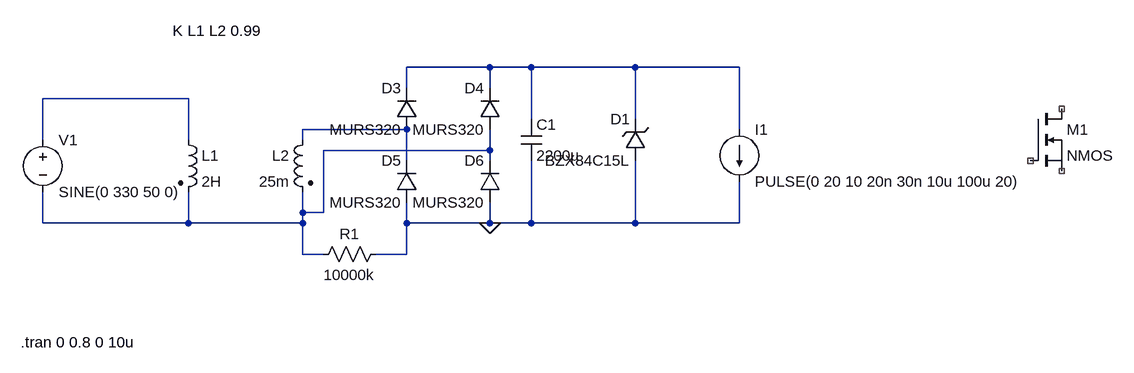
[diagram p0: schematic DRSSTC_driver_supply.asc]
DRSSTC_driver_supply.asc, the LTspice schematic file:
Version 4
SHEET 1 1932 964
WIRE -80 48 -208 48
WIRE -16 48 -80 48
WIRE 144 48 -16 48
WIRE 304 48 144 48
WIRE -208 80 -208 48
WIRE -80 80 -80 48
WIRE -544 96 -768 96
WIRE -16 128 -16 48
WIRE 144 128 144 48
WIRE -208 144 -368 144
WIRE 304 144 304 48
WIRE -768 160 -768 96
WIRE -544 160 -544 96
WIRE -368 160 -368 144
WIRE -80 176 -80 144
WIRE -80 176 -336 176
WIRE -208 192 -208 144
WIRE -80 192 -80 176
WIRE -368 272 -368 240
WIRE -336 272 -336 176
WIRE -336 272 -368 272
WIRE -768 288 -768 240
WIRE -544 288 -544 240
WIRE -544 288 -768 288
WIRE -368 288 -368 272
WIRE -368 288 -544 288
WIRE -208 288 -208 256
WIRE -80 288 -80 256
WIRE -80 288 -208 288
WIRE -16 288 -16 192
WIRE -16 288 -80 288
WIRE 144 288 144 192
WIRE 144 288 -16 288
WIRE 304 288 304 224
WIRE 304 288 144 288
WIRE -368 336 -368 288
WIRE -336 336 -368 336
WIRE -208 336 -208 288
WIRE -208 336 -256 336
FLAG -80 288 0
SYMBOL zener 160 192 R180
WINDOW 0 24 64 Left 2
WINDOW 3 24 0 Left 2
SYMATTR InstName D1
SYMATTR Value BZX84C15L
SYMBOL ind2 -560 144 R0
SYMATTR InstName L1
SYMATTR Value 2H
SYMATTR Type ind
SYMATTR SpiceLine Rser=1k
SYMBOL ind2 -352 144 M0
SYMATTR InstName L2
SYMATTR Value 25m
SYMATTR Type ind
SYMATTR SpiceLine Rser=53
SYMBOL voltage -768 144 R0
WINDOW 123 0 0 Left 2
WINDOW 39 0 0 Left 2
SYMATTR InstName V1
SYMATTR Value SINE(0 330 50 0)
SYMBOL diode -192 144 R180
WINDOW 0 24 64 Left 2
WINDOW 3 24 0 Left 2
SYMATTR InstName D3
SYMATTR Value MURS320
SYMBOL diode -64 144 R180
WINDOW 0 24 64 Left 2
WINDOW 3 24 0 Left 2
SYMATTR InstName D4
SYMATTR Value MURS320
SYMBOL diode -192 256 R180
WINDOW 0 24 64 Left 2
WINDOW 3 24 0 Left 2
SYMATTR InstName D5
SYMATTR Value MURS320
SYMBOL diode -64 256 R180
WINDOW 0 24 64 Left 2
WINDOW 3 24 0 Left 2
SYMATTR InstName D6
SYMATTR Value MURS320
SYMBOL cap -32 128 R0
SYMATTR InstName C1
SYMATTR Value 2200µ
SYMBOL res -240 320 R90
WINDOW 0 0 56 VBottom 2
WINDOW 3 32 56 VTop 2
SYMATTR InstName R1
SYMATTR Value 10000k
SYMBOL current 304 144 R0
WINDOW 123 0 0 Left 2
WINDOW 39 0 0 Left 2
SYMATTR InstName I1
SYMATTR Value PULSE(0 20 10 20n 30n 10u 100u 20)
SYMBOL nmos 752 112 R0
SYMATTR InstName M1
TEXT -568 -8 Left 2 !K L1 L2 0.99
TEXT -802 472 Left 2 !.tran 0 0.8 0 10u

The netlist it stands for:
* DRSSTC_driver_supply.asc
D1 0 N001 BZX84C15L
L1 N002 N004 2H Rser=1k
L2 N003 N004 25m Rser=53
V1 N002 N004 SINE(0 330 50 0)
D3 N003 N001 MURS320
D4 N004 N001 MURS320
D5 0 N003 MURS320
D6 0 N004 MURS320
C1 N001 0 2200µ
R1 0 N004 10000k
I1 N001 0 PULSE(0 20 10 20n 30n 10u 100u 20)
M1 NC_01 NC_02 NC_03 NC_03 NMOS
.model D D
.lib standard.dio
.model NMOS NMOS
.model PMOS PMOS
.lib standard.mos
K L1 L2 0.99
.tran 0 0.8 0 10u
.backanno
.end